# Altium schematic sheet _light_humid.SchDoc
size Tabloid
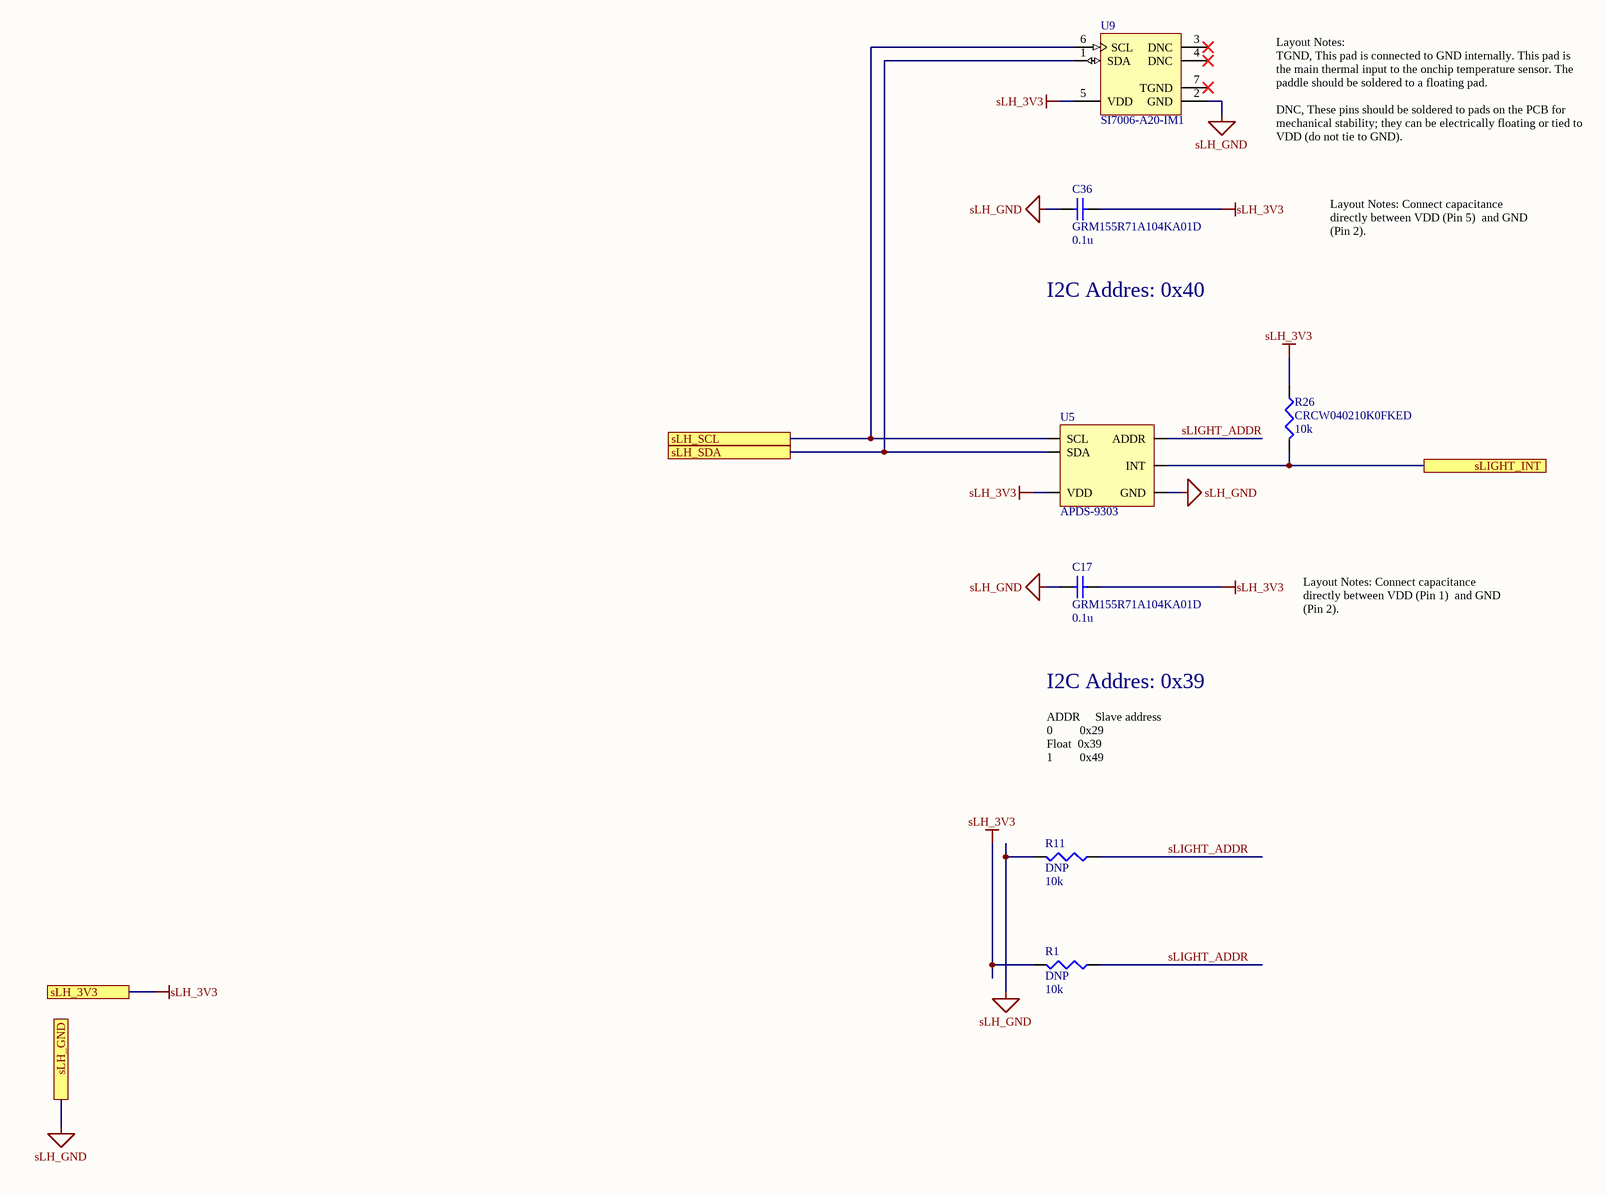
[diagram p0: _light_humid.SchDoc]

## Parts
C17  GRM155R71A104KA01D  value 0.1u  [0402]
C36  GRM155R71A104KA01D  value 0.1u  [0402]
R1  DNP  value 10k  [0402]
R11  DNP  value 10k  [0402]
R26  CRCW040210K0FKED  value 10k  [0402]
U5  APDS-9303  [APDS-9303]
U9  SI7006-A20-IM1  [SLAB-DFN-6-1500X2400TP_V]

## Ports
sLH_3V3, sLH_GND, sLH_SCL, sLH_SDA, sLIGHT_INT

## Nets
sLH_3V3: C17.2 C36.2 R1.2 R26.1 U5.1(VDD) U9.5(VDD) ; port sLH_3V3
sLH_GND: C17.1 C36.1 R11.2 U5.2(GND) U9.2(GND) ; port sLH_GND
sLH_SCL: U5.4(SCL) U9.6(SCL) ; port sLH_SCL
sLH_SDA: U5.5(SDA) U9.1(SDA) ; port sLH_SDA
sLIGHT_ADDR: R1.1 R11.1 U5.3(ADDR)
sLIGHT_INT: R26.2 U5.6(INT) ; port sLIGHT_INT

Not connected (* = marked no-connect by the designer): U9 3(DNC)* 4(DNC)* 7(TGND)*

## Notes on the sheet
- Layout Notes:
  TGND, This pad is connected to GND internally. This pad is the main thermal input to the onchip temperature sensor. The paddle should be soldered to a floating pad.
  DNC, These pins should be soldered to pads on the PCB for mechanical stability; they can be electrically floating or tied to VDD (do not tie to GND).
- Layout Notes: Connect capacitance directly between VDD (Pin 5)  and GND (Pin 2).
- I2C Addres: 0x40
- Layout Notes: Connect capacitance directly between VDD (Pin 1)  and GND (Pin 2).
- I2C Addres: 0x39
- ADDR     Slave address
  0         0x29
  Float  0x39
  1         0x49

## Library data of the parts
C17 C36 = GRM155R71AxxxKdddd: -55-125C, 1005, 10V, X7R, ±10%
R1 R11 R26 = CRCW0402xxxxFKED: 0.125W, -55-155C, 1005, 50V, ±1%
U9 = CMP-2000-07060-1: I2C Humidity and Temperature Sensor, 1.9 to 3.6 V, -40 to 125 degC, 6-Pin DFN, RoHS, Tube; Manufacturer: Silicon Labs; Output Type: Digital; Resolution: 12(Humidity)bit,14(Temperature)bit; Minimum Operating Supply Voltage: 1.9V; Sensor Function: Temperature&Humidity; Accuracy: ±1°C,±5%RH; Maximum Operating Supply Voltage: 3.6V; Pin Count: 6; Maximum Operating Temperature: +125°C; Package Reference: DFN-6; Height: 0.75mm; Datasheet URL: https://www.silabs.com/Support%20Documents%2FTechnicalDocs%2FSi7006-A20.pdf; Datasheet Version: Rev. 1.1, 06/2015; Package Type: DFN; Mounting Technology: SurfaceMount; Dimensions: 3x3x0.75mm; Length: 3mm; Package Description: 6-Pin Small Outline No-Lead Package, Body 3 x 3 mm, Pitch 1 mm; Minimum Operating Temperature: -40°C; Interface Type: I2C; Mounting Type: SurfaceMount; Width: 3mm; Manufacturer URL: http://www.silabs.com/